# Altium project OBDIIBoard_MCP2551.PrjPcb
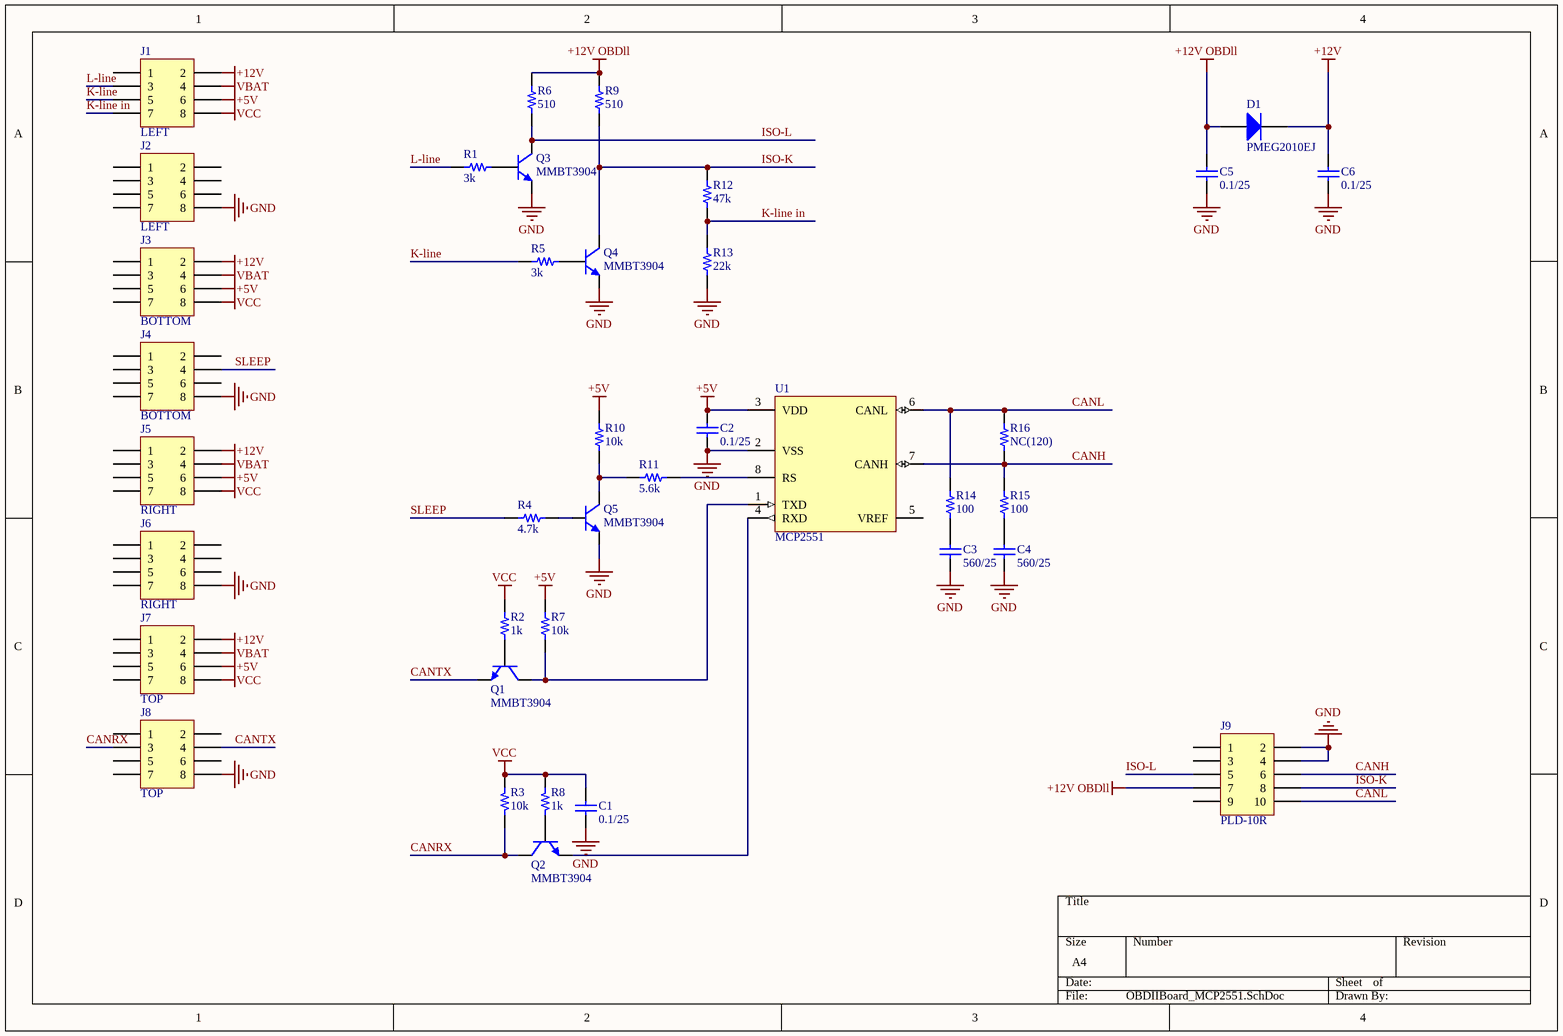
[diagram p0: OBDIIBoard_MCP2551.SchDoc]
1 sheet, 38 parts. Net scope: global (net labels, ports and power ports of the same name join across sheets).
Board file: OBDIIBoard_MCP2551.PcbDoc

## Sheet OBDIIBoard_MCP2551.SchDoc
size A4

### Parts
C1  0.1/25  [CAP0402]
C2  0.1/25  [CAP0402]
C3  560/25  [CAP0402]
C4  560/25  [CAP0402]
C5  0.1/25  [CAP0402]
C6  0.1/25  [CAP0402]
D1  PMEG2010EJ  [SOD523]
J1  LEFT  [PBDM-8]
J2  LEFT  [PBDM-8]
J3  BOTTOM  [PBDM-8]
J4  BOTTOM  [PBDM-8]
J5  RIGHT  [PBDM-8]
J6  RIGHT  [PBDM-8]
J7  TOP  [PBDM-8]
J8  TOP  [PBDM-8]
J9  PLD-10R  [PLD-10R]
Q1  MMBT3904  [SOT23]
Q2  MMBT3904  [SOT23]
Q3  MMBT3904  [SOT23]
Q4  MMBT3904  [SOT23]
Q5  MMBT3904  [SOT23]
R1  3k  [RES0402]
R2  1k  [RES0402]
R3  10k  [RES0402]
R4  4.7k  [RES0402]
R5  3k  [RES0402]
R6  510  [RES2512]
R7  10k  [RES0402]
R8  1k  [RES0402]
R9  510  [RES2512]
R10  10k  [RES0402]
R11  5.6k  [RES0402]
R12  47k  [RES0402]
R13  22k  [RES0402]
R14  100  [RES0402]
R15  100  [RES0402]
R16  NC(120)  [RES0402]
U1  MCP2551  [SO8]

### Nets
+5V: C2.2 J1.6 J3.6 J5.6 J7.6 R7.1 R10.2 U1.3(VDD)
+12V: C6.2 D1.1 J1.2 J3.2 J5.2 J7.2
+12V OBDll: C5.2 D1.2 J9.7 R6.2 R9.2
GND: C1.1 C2.1 C3.1 C4.1 C5.1 C6.1 J2.8 J4.8 J6.8 J8.8 J9.2 J9.4 Q3.2 Q4.2 Q5.2 R13.2 U1.2(VSS)
VBAT: J1.4 J3.4 J5.4 J7.4
VCC: C1.2 J1.8 J3.8 J5.8 J7.8 R2.1 R3.1 R8.1
CANH: J9.6 R15.2 R16.1 U1.7(CANH)
CANL: J9.10 R14.2 R16.2 U1.6(CANL)
CANRX: J8.3 Q2.3 R3.2
CANTX: J8.4 Q1.2
ISO-K: J9.8 Q4.3 R9.1 R12.1
ISO-L: J9.5 Q3.3 R6.1
K-line: J1.5 R5.2
K-line in: J1.7 R12.2 R13.1
L-line: J1.3 R1.2
SLEEP: J4.4 R4.2
NetC3_2: C3.2 R14.1
NetC4_2: C4.2 R15.1
NetQ1_1: Q1.1 R2.2
NetQ1_3: Q1.3 R7.2 U1.1(TXD)
NetQ2_1: Q2.1 R8.2
NetQ2_2: Q2.2 U1.4(RXD)
NetQ3_1: Q3.1 R1.1
NetQ4_1: Q4.1 R5.1
NetQ5_1: Q5.1 R4.1
NetQ5_3: Q5.3 R10.1 R11.2
NetR11_1: R11.1 U1.8(RS)

Not connected (* = marked no-connect by the designer): J1 1; J2 1 2 3 4 5 6 7; J3 1 3 5 7; J4 1 2 3 5 6 7; J5 1 3 5 7; J6 1 2 3 4 5 6 7; J7 1 3 5 7; J8 1 2 5 6 7; J9 1 3 9; U1 5(VREF)

### Library data of the parts
C1 C2 C5 C6 = CAP0402: Ceramic chip capacitor 0402; Value: 0.1; Voltage: 25; PartNumber: CAP0402; Category: Capacitor; Author: oiezhov
C3 C4 = CAP0402: Ceramic chip capacitor 0402; Value: 560; Voltage: 25; PartNumber: CAP0402; Category: Capacitor; Author: oiezhov
D1 = PMEG2010EJ: 1 A very low VF MEGA Schottky barrier rectifiers; PartNumber: PMEG2010EJ; Category: Diode; ComponentLink1Description: Datasheet; ComponentLink1URL: d:\_AltiumLibs\Pdf\Discrete\Diode\PMEG2010EH_EJ_ET.pdf; Author: oiezhov
J1-J8 = PBDM-8: 2x4-pin header, pitch 2.54 mm; PartNumber: PBDM-8; Category: Connector; ComponentLink1Description: Datasheet; ComponentLink1URL: d:\_AltiumLibs\Pdf\Mechanical\Connector\pbsm.pdf; Author: oiezhov
J9 = PLD-10R: Angle 2x5-pin header, pitch 2.54 mm; PartNumber: PLD-10R; Category: Connector; ComponentLink1Description: Datasheet; ComponentLink1URL: d:\_AltiumLibs\Pdf\Mechanical\Connector\PLS, PLD.pdf; Author: oiezhov
Q1-Q5 = MMBT3904: NPN General Purpose Transistor; PartNumber: MMBT3904; Category: Transistor; ComponentLink1Description: Datasheet; ComponentLink1URL: d:\_AltiumLibs\Pdf\Discrete\Transistor\MMBT3904.pdf; Author: oiezhov
R1-R5 R7 R8 R10-R16 = RES0402: Ceramic chip resistor; PartNumber: RES0402; Category: Resistor; Author: oiezhov
  R1 R5: Value: 3k
  R2 R8: Value: 1k
  R3 R7 R10: Value: 10k
  R4: Value: 4.7k
  R11: Value: 5.6k
  R12: Value: 47k
  R13: Value: 22k
  R14 R15: Value: 100
  R16: Value: NC(120)
R6 R9 = RES2512: Ceramic chip resistor; PartNumber: RES2512; Value: 510; Category: Resistor; Author: oiezhov
U1 = MCP2551: High-Speed CAN Transceiver; PartNumber: MCP2551; Category: IC/Interface; ComponentLink1Description: Datasheet; ComponentLink1URL: d:\_AltiumLibs\Pdf\IC\Interface\MCP2551.pdf